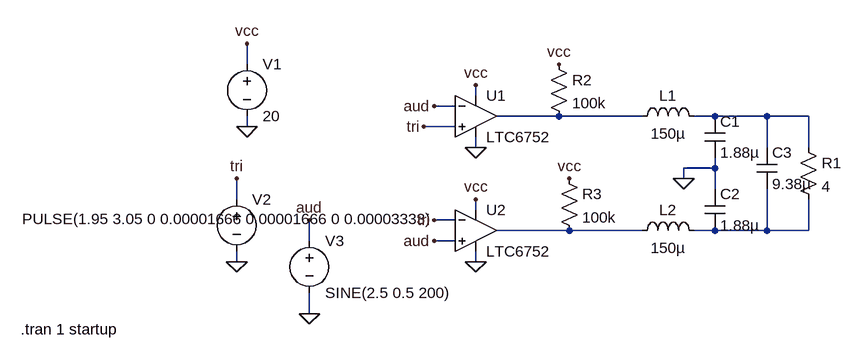
[diagram p0: schematic trans.asc]
trans.asc, the LTspice schematic file:
Version 4
SHEET 1 880 680
WIRE -304 16 -304 -16
WIRE 48 64 48 48
WIRE 16 80 -16 80
WIRE 176 96 80 96
WIRE 304 96 176 96
WIRE 416 96 384 96
WIRE 496 96 416 96
WIRE 560 96 496 96
WIRE -304 112 -304 96
WIRE 16 112 -32 112
WIRE 48 144 48 128
WIRE 496 144 496 96
WIRE 560 144 560 96
WIRE 416 176 416 160
WIRE 416 176 368 176
WIRE 368 192 368 176
WIRE 416 208 416 176
WIRE -320 224 -320 192
WIRE 48 240 48 224
WIRE 16 256 -16 256
WIRE 192 272 80 272
WIRE 304 272 192 272
WIRE 416 272 384 272
WIRE 496 272 496 208
WIRE 496 272 416 272
WIRE 560 272 560 224
WIRE 560 272 496 272
WIRE -208 288 -208 256
WIRE 16 288 -16 288
WIRE -320 320 -320 304
WIRE 48 320 48 304
WIRE -208 400 -208 368
FLAG 368 192 0
FLAG -304 -16 vcc
FLAG -304 112 0
FLAG 48 48 vcc
FLAG 48 224 vcc
FLAG 48 320 0
FLAG 48 144 0
FLAG -208 400 0
FLAG -320 320 0
FLAG -320 192 tri
FLAG -208 256 aud
FLAG -32 112 tri
FLAG -16 256 tri
FLAG -16 288 aud
FLAG -16 80 aud
FLAG 176 16 vcc
FLAG 192 192 vcc
SYMBOL ind 288 112 R270
WINDOW 0 32 56 VTop 2
WINDOW 3 5 56 VBottom 2
SYMATTR InstName L1
SYMATTR Value 150µ
SYMBOL ind 288 288 R270
WINDOW 0 32 56 VTop 2
WINDOW 3 5 56 VBottom 2
SYMATTR InstName L2
SYMATTR Value 150µ
SYMBOL cap 400 96 R0
SYMATTR InstName C1
SYMATTR Value 1.88µ
SYMBOL cap 400 208 R0
SYMATTR InstName C2
SYMATTR Value 1.88µ
SYMBOL cap 480 144 R0
SYMATTR InstName C3
SYMATTR Value 9.38µ
SYMBOL res 544 128 R0
SYMATTR InstName R1
SYMATTR Value 4
SYMBOL Comparators\\LTC6752 48 32 R0
SYMATTR InstName U1
SYMBOL Comparators\\LTC6752 48 208 R0
SYMATTR InstName U2
SYMBOL voltage -304 0 R0
WINDOW 123 0 0 Left 0
WINDOW 39 24 124 Left 2
SYMATTR InstName V1
SYMATTR Value 20
SYMBOL voltage -320 208 R0
WINDOW 3 -330 46 Left 2
WINDOW 123 0 0 Left 0
WINDOW 39 0 0 Left 0
SYMATTR InstName V2
SYMATTR Value PULSE(1.95 3.05 0 0.00001666 0.00001666 0 0.00003333)
SYMBOL voltage -208 272 R0
WINDOW 123 0 0 Left 0
WINDOW 39 0 0 Left 0
SYMATTR InstName V3
SYMATTR Value SINE(2.5 0.5 200)
SYMBOL res 160 0 R0
SYMATTR InstName R2
SYMATTR Value 100k
SYMBOL res 176 176 R0
SYMATTR InstName R3
SYMATTR Value 100k
TEXT -652 424 Left 2 !.tran 1 startup

The netlist it stands for:
* trans.asc
L1 N001 N002 150µ
L2 N003 N004 150µ
C1 N002 0 1.88µ
C2 0 N004 1.88µ
C3 N002 N004 9.38µ
R1 N002 N004 4
XU1 tri aud vcc 0 N001 LTC6752  ; pins In+ In- V+ V- OUT
XU2 aud tri vcc 0 N003 LTC6752  ; pins In+ In- V+ V- OUT
V1 vcc 0 20
V2 tri 0 PULSE(1.95 3.05 0 0.00001666 0.00001666 0 0.00003333)
V3 aud 0 SINE(2.5 0.5 200)
R2 vcc N001 100k
R3 vcc N003 100k
.tran 1 startup
.lib LTC7.lib
.backanno
.end